# Altium schematic sheet System Block.SchDoc
size A0; SheetNumber: 1; SheetTotal: 9
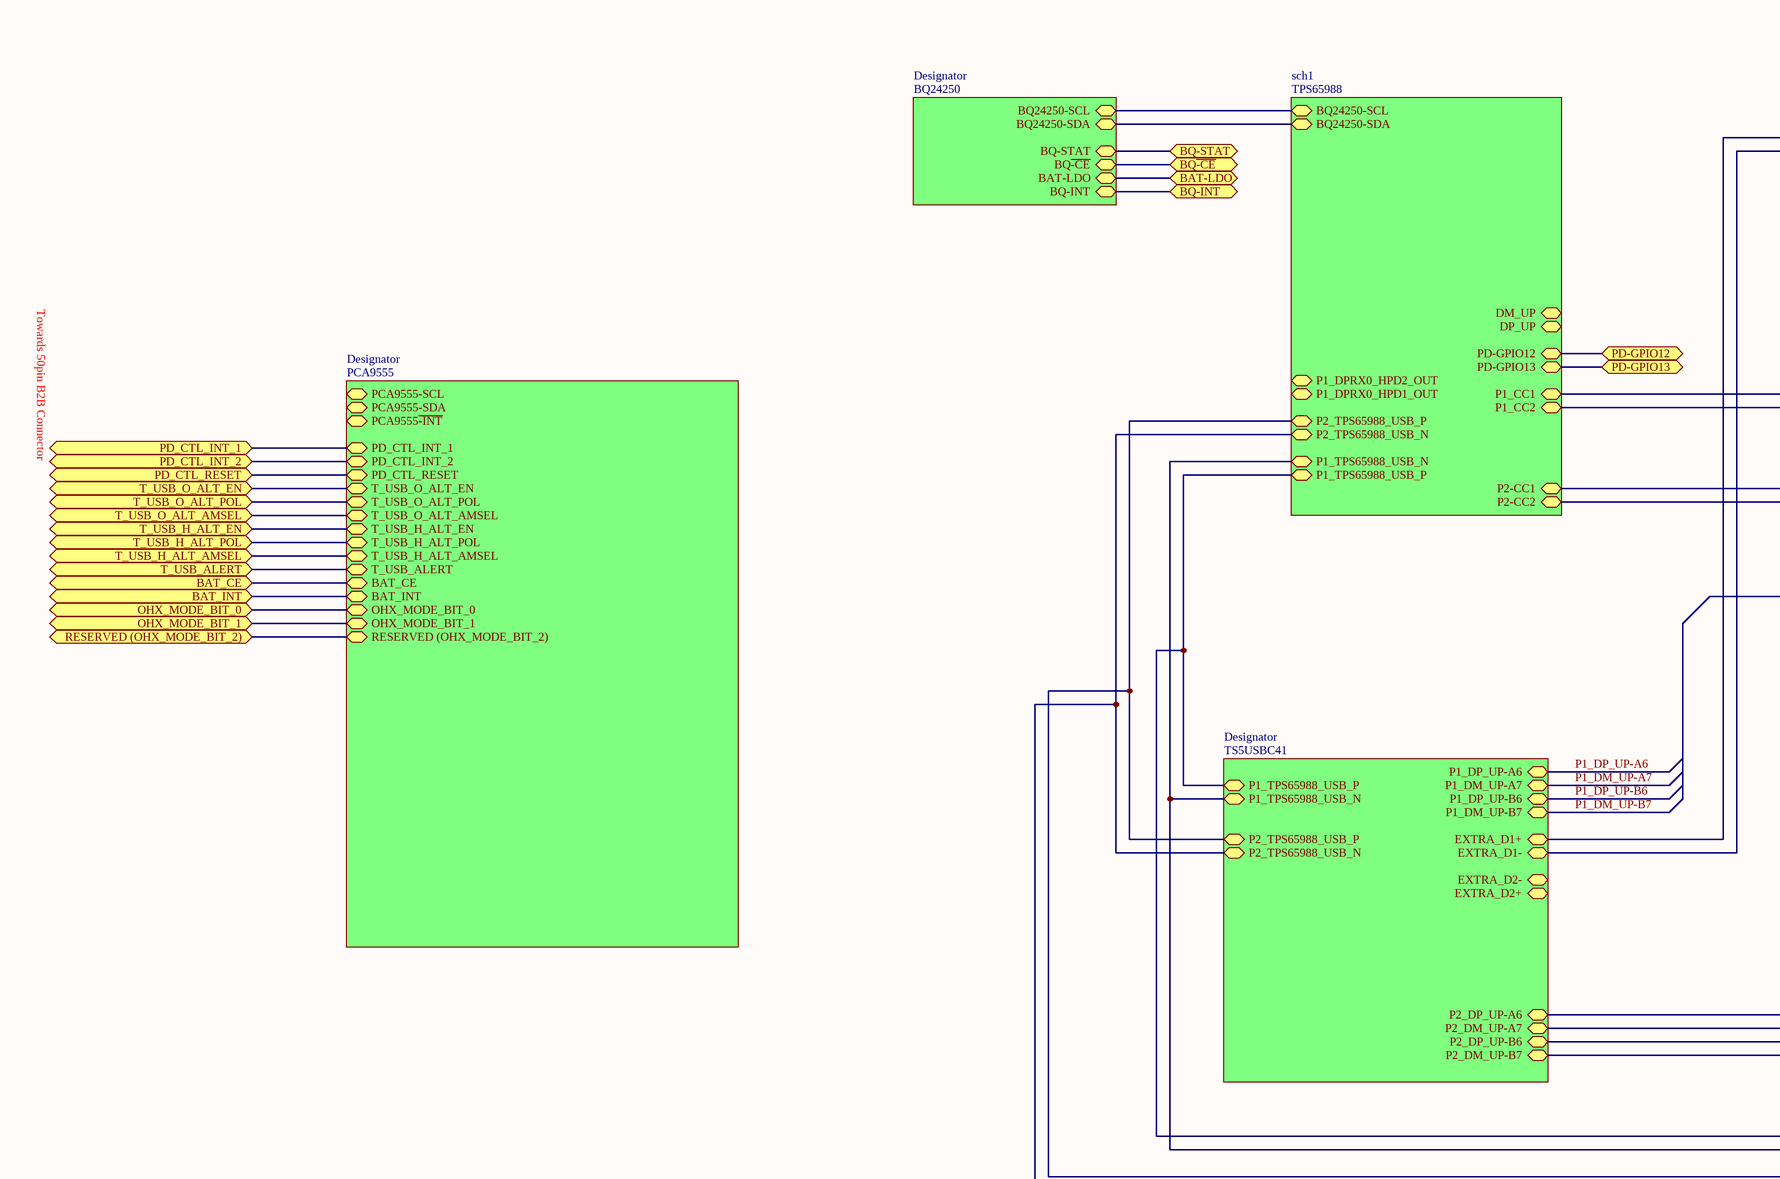
[diagram p0: System Block.SchDoc, top left]
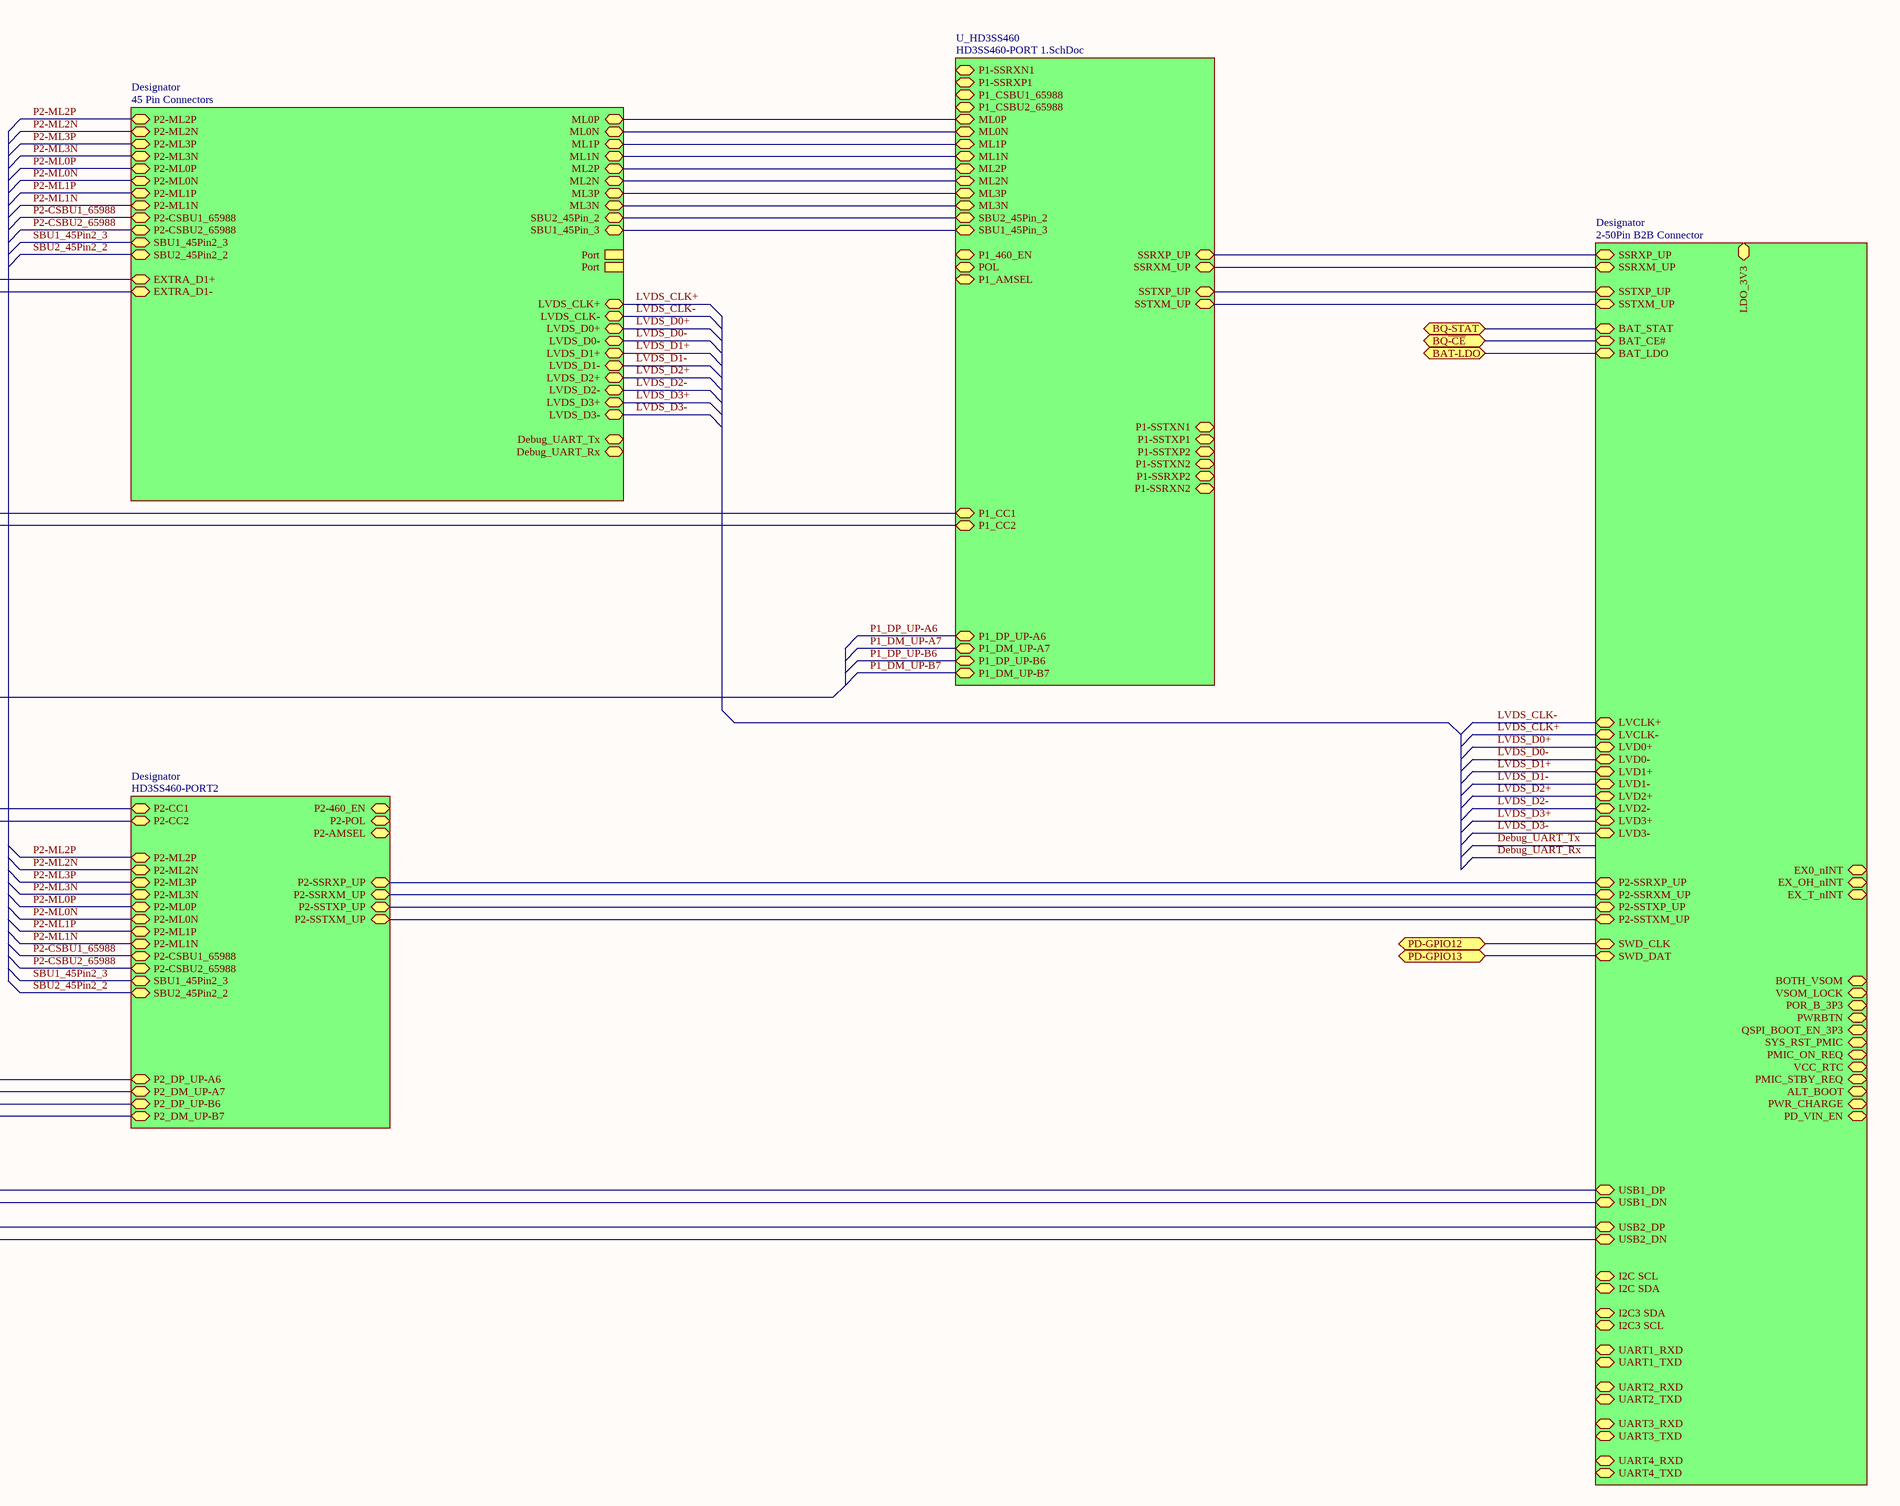
[diagram p1: System Block.SchDoc, top right]

## Sub-sheets
Designator = TS5USBC41: P1_DM_UP-A7 (bidir), P1_DP_UP-A6 (bidir), P1_DP_UP-B6 (bidir), P1_DM_UP-B7 (bidir), P1_TPS65988_USB_P (bidir), P1_TPS65988_USB_N (bidir), P2_DP_UP-A6 (bidir), P2_DM_UP-A7 (bidir), P2_DP_UP-B6 (bidir), P2_DM_UP-B7 (bidir), P2_TPS65988_USB_P (bidir), P2_TPS65988_USB_N (bidir), EXTRA_D2+ (bidir), EXTRA_D2- (bidir), EXTRA_D1+ (bidir), EXTRA_D1- (bidir)
Designator = HD3SS460-PORT2: P2_DP_UP-A6 (bidir), P2-CSBU1_65988 (bidir), P2-AMSEL (bidir), P2-POL (bidir), P2-CSBU2_65988 (bidir), P2-CC1 (bidir), P2-CC2 (bidir), P2-SSTXP_UP (bidir), P2-SSTXM_UP (bidir), P2-SSRXM_UP (bidir), P2-SSRXP_UP (bidir), P2-ML2P (bidir), P2-ML2N (bidir), P2-ML3P (bidir), P2-ML3N (bidir), P2-ML0P (bidir), P2-ML0N (bidir), P2-460_EN (bidir), P2-ML1P (bidir), P2-ML1N (bidir), P2_DM_UP-A7 (bidir), P2_DP_UP-B6 (bidir), P2_DM_UP-B7 (bidir), SBU1_45Pin2_3 (bidir), SBU2_45Pin2_2 (bidir)
Designator = BQ24250: BQ-STAT (bidir), BQ~{-CE} (bidir), BQ-INT (bidir), BQ24250-SCL (bidir), BQ24250-SDA (bidir), BAT-LDO (bidir)
Designator = 2-50Pin B2B Connector: USB1_DN (bidir), USB1_DP (bidir), USB2_DP (bidir), USB2_DN (bidir), SWD_CLK (bidir), SWD_DAT (bidir), BOTH_VSOM (bidir), EX0_nINT (bidir), EX_T_nINT (bidir), EX_OH_nINT (bidir), VSOM_LOCK (bidir), SYS_RST_PMIC (bidir), PMIC_ON_REQ (bidir), POR_B_3P3 (bidir), PMIC_STBY_REQ (bidir), ALT_BOOT (bidir), PWRBTN (bidir), PWR_CHARGE (bidir), BAT_CE# (bidir), QSPI_BOOT_EN_3P3 (bidir), PD_VIN_EN (bidir), BAT_STAT (bidir), BAT_LDO (bidir), VCC_RTC (bidir), LDO_3V3 (bidir), I2C3 SDA (bidir), I2C3 SCL (bidir), LVD3- (bidir), LVD3+ (bidir), LVD2- (bidir), I2C SCL (bidir), I2C SDA (bidir), UART4_RXD (bidir), UART4_TXD (bidir), LVD2+ (bidir), UART3_RXD (bidir), LVD1+ (bidir), UART3_TXD (bidir), LVD1- (bidir), LVD0- (bidir), UART2_RXD (bidir), UART2_TXD (bidir), LVD0+ (bidir), UART1_TXD (bidir), UART1_RXD (bidir), LVCLK+ (bidir), LVCLK- (bidir), SSRXP_UP (bidir), SSRXM_UP (bidir), SSTXP_UP (bidir), SSTXM_UP (bidir), P2-SSRXP_UP (bidir), P2-SSRXM_UP (bidir), P2-SSTXP_UP (bidir), P2-SSTXM_UP (bidir)
Designator = 45 Pin Connectors: SBU2_45Pin_2 (bidir), SBU1_45Pin_3 (bidir), ML0N (bidir), ML0P (bidir), ML1P (bidir), ML1N (bidir), ML2P (bidir), ML2N (bidir), ML3P (bidir), ML3N (bidir), EXTRA_D1+ (bidir), Port, EXTRA_D1- (bidir), Port, LVDS_CLK- (bidir), LVDS_CLK+ (bidir), LVDS_D0+ (bidir), LVDS_D0- (bidir), LVDS_D1+ (bidir), LVDS_D1- (bidir), LVDS_D2+ (bidir), LVDS_D2- (bidir), LVDS_D3- (bidir), LVDS_D3+ (bidir), Debug_UART_Tx (bidir), Debug_UART_Rx (bidir), P2-ML2P (bidir), P2-ML2N (bidir), P2-ML3P (bidir), P2-ML3N (bidir), P2-ML0P (bidir), P2-ML0N (bidir), P2-ML1P (bidir), P2-ML1N (bidir), P2-CSBU1_65988 (bidir), P2-CSBU2_65988 (bidir), SBU1_45Pin2_3 (bidir), SBU2_45Pin2_2 (bidir)
Designator = PCA9555: PCA9555-SCL (bidir), PCA9555-SDA (bidir), PCA9555~{-INT} (bidir), PD_CTL_INT_1 (bidir), PD_CTL_INT_2 (bidir), PD_CTL_RESET (bidir), T_USB_O_ALT_EN (bidir), T_USB_O_ALT_POL (bidir), T_USB_O_ALT_AMSEL (bidir), T_USB_H_ALT_EN (bidir), T_USB_H_ALT_POL (bidir), T_USB_H_ALT_AMSEL (bidir), T_USB_ALERT (bidir), BAT_CE (bidir), BAT_INT (bidir), OHX_MODE_BIT_0 (bidir), OHX_MODE_BIT_1 (bidir), RESERVED (OHX_MODE_BIT_2) (bidir)
sch1 = TPS65988: DM_UP (bidir), DP_UP (bidir), P1_CC1 (bidir), P1_CC2 (bidir), P1_DPRX0_HPD1_OUT (bidir), P1_DPRX0_HPD2_OUT (bidir), P1_TPS65988_USB_P (bidir), P1_TPS65988_USB_N (bidir), P2_TPS65988_USB_P (bidir), P2_TPS65988_USB_N (bidir), P2-CC1 (bidir), P2-CC2 (bidir), BQ24250-SCL (bidir), BQ24250-SDA (bidir), PD-GPIO12 (bidir), PD-GPIO13 (bidir)
U_HD3SS460 = HD3SS460-PORT 1.SchDoc: P1_CC2 (bidir), P1_CSBU1_65988 (bidir), P1_CSBU2_65988 (bidir), P1_DM_UP-A7 (bidir), P1_DP_UP-A6 (bidir), POL (bidir), P1_AMSEL (bidir), P1_460_EN (bidir), ML1P (bidir), ML1N (bidir), ML0N (bidir), ML0P (bidir), ML3N (bidir), ML3P (bidir), ML2P (bidir), ML2N (bidir), SSTXM_UP (bidir), SSTXP_UP (bidir), SSRXP_UP (bidir), SSRXM_UP (bidir), P1_DP_UP-B6 (bidir), P1_DM_UP-B7 (bidir), P1-SSRXP1 (bidir), P1-SSRXN1 (bidir), P1-SSTXP1 (bidir), P1-SSTXN1 (bidir), P1-SSRXP2 (bidir), P1-SSRXN2 (bidir), P1-SSTXP2 (bidir), P1-SSTXN2 (bidir), SBU1_45Pin_3 (bidir), SBU2_45Pin_2 (bidir), P1_CC1 (bidir)

## Ports
BAT-LDO (bidir), BAT_CE (bidir), BAT_INT (bidir), BQ-INT (bidir), BQ-STAT (bidir), BQ~{-CE} (bidir), OHX_MODE_BIT_0 (bidir), OHX_MODE_BIT_1 (bidir), PD-GPIO12 (bidir), PD-GPIO13 (bidir), PD_CTL_INT_1 (bidir), PD_CTL_INT_2 (bidir), PD_CTL_RESET (bidir), RESERVED (OHX_MODE_BIT_2) (bidir), T_USB_ALERT (bidir), T_USB_H_ALT_AMSEL (bidir), T_USB_H_ALT_EN (bidir), T_USB_H_ALT_POL (bidir), T_USB_O_ALT_AMSEL (bidir), T_USB_O_ALT_EN (bidir), T_USB_O_ALT_POL (bidir)

## Nets
BAT-LDO: port BAT-LDO, sheet Designator/BAT-LDO, sheet Designator/BAT_LDO
BAT_CE: port BAT_CE, sheet Designator/BAT_CE
BAT_INT: port BAT_INT, sheet Designator/BAT_INT
BQ~{-CE}: port BQ~{-CE}, sheet Designator/BQ~{-CE}, sheet Designator/BAT_CE#
BQ-INT: port BQ-INT, sheet Designator/BQ-INT
BQ-STAT: port BQ-STAT, sheet Designator/BQ-STAT, sheet Designator/BAT_STAT
LVDS_CLK+: sheet Designator/LVCLK-, sheet Designator/LVDS_CLK+
LVDS_CLK-: sheet Designator/LVCLK+, sheet Designator/LVDS_CLK-
LVDS_D0+: sheet Designator/LVD0+, sheet Designator/LVDS_D0+
LVDS_D0-: sheet Designator/LVD0-, sheet Designator/LVDS_D0-
LVDS_D1+: sheet Designator/LVD1+, sheet Designator/LVDS_D1+
LVDS_D1-: sheet Designator/LVD1-, sheet Designator/LVDS_D1-
LVDS_D2+: sheet Designator/LVD2+, sheet Designator/LVDS_D2+
LVDS_D2-: sheet Designator/LVD2-, sheet Designator/LVDS_D2-
LVDS_D3+: sheet Designator/LVD3+, sheet Designator/LVDS_D3+
LVDS_D3-: sheet Designator/LVD3-, sheet Designator/LVDS_D3-
OHX_MODE_BIT_0: port OHX_MODE_BIT_0, sheet Designator/OHX_MODE_BIT_0
OHX_MODE_BIT_1: port OHX_MODE_BIT_1, sheet Designator/OHX_MODE_BIT_1
P1_DM_UP-A7: sheet U_HD3SS460/P1_DM_UP-A7, sheet Designator/P1_DM_UP-A7
P1_DM_UP-B7: sheet U_HD3SS460/P1_DM_UP-B7, sheet Designator/P1_DM_UP-B7
P1_DP_UP-A6: sheet U_HD3SS460/P1_DP_UP-A6, sheet Designator/P1_DP_UP-A6
P1_DP_UP-B6: sheet U_HD3SS460/P1_DP_UP-B6, sheet Designator/P1_DP_UP-B6
P2-CSBU1_65988: sheet Designator/P2-CSBU1_65988, sheet Designator/P2-CSBU1_65988
P2-CSBU2_65988: sheet Designator/P2-CSBU2_65988, sheet Designator/P2-CSBU2_65988
P2-ML0N: sheet Designator/P2-ML0N, sheet Designator/P2-ML0N
P2-ML0P: sheet Designator/P2-ML0P, sheet Designator/P2-ML0P
P2-ML1N: sheet Designator/P2-ML1N, sheet Designator/P2-ML1N
P2-ML1P: sheet Designator/P2-ML1P, sheet Designator/P2-ML1P
P2-ML2N: sheet Designator/P2-ML2N, sheet Designator/P2-ML2N
P2-ML2P: sheet Designator/P2-ML2P, sheet Designator/P2-ML2P
P2-ML3N: sheet Designator/P2-ML3N, sheet Designator/P2-ML3N
P2-ML3P: sheet Designator/P2-ML3P, sheet Designator/P2-ML3P
PD-GPIO12: port PD-GPIO12, sheet sch1/PD-GPIO12, sheet Designator/SWD_CLK
PD-GPIO13: port PD-GPIO13, sheet sch1/PD-GPIO13, sheet Designator/SWD_DAT
PD_CTL_INT_1: port PD_CTL_INT_1, sheet Designator/PD_CTL_INT_1
PD_CTL_INT_2: port PD_CTL_INT_2, sheet Designator/PD_CTL_INT_2
PD_CTL_RESET: port PD_CTL_RESET, sheet Designator/PD_CTL_RESET
RESERVED (OHX_MODE_BIT_2): port RESERVED (OHX_MODE_BIT_2), sheet Designator/RESERVED (OHX_MODE_BIT_2)
SBU1_45Pin2_3: sheet Designator/SBU1_45Pin2_3, sheet Designator/SBU1_45Pin2_3
SBU2_45Pin2_2: sheet Designator/SBU2_45Pin2_2, sheet Designator/SBU2_45Pin2_2
T_USB_ALERT: port T_USB_ALERT, sheet Designator/T_USB_ALERT
T_USB_H_ALT_AMSEL: port T_USB_H_ALT_AMSEL, sheet Designator/T_USB_H_ALT_AMSEL
T_USB_H_ALT_EN: port T_USB_H_ALT_EN, sheet Designator/T_USB_H_ALT_EN
T_USB_H_ALT_POL: port T_USB_H_ALT_POL, sheet Designator/T_USB_H_ALT_POL
T_USB_O_ALT_AMSEL: port T_USB_O_ALT_AMSEL, sheet Designator/T_USB_O_ALT_AMSEL
T_USB_O_ALT_EN: port T_USB_O_ALT_EN, sheet Designator/T_USB_O_ALT_EN
T_USB_O_ALT_POL: port T_USB_O_ALT_POL, sheet Designator/T_USB_O_ALT_POL
(unnamed): sheet sch1/P1_CC1, sheet U_HD3SS460/P1_CC1
(unnamed): sheet sch1/P1_CC2, sheet U_HD3SS460/P1_CC2
(unnamed): sheet sch1/P1_TPS65988_USB_P, sheet Designator/P1_TPS65988_USB_P, sheet Designator/USB1_DP
(unnamed): sheet sch1/P1_TPS65988_USB_N, sheet Designator/P1_TPS65988_USB_N, sheet Designator/USB1_DN
(unnamed): sheet sch1/P2_TPS65988_USB_P, sheet Designator/P2_TPS65988_USB_P, sheet Designator/USB2_DP
(unnamed): sheet sch1/P2_TPS65988_USB_N, sheet Designator/P2_TPS65988_USB_N, sheet Designator/USB2_DN
(unnamed): sheet sch1/P2-CC1, sheet Designator/P2-CC1
(unnamed): sheet sch1/P2-CC2, sheet Designator/P2-CC2
(unnamed): sheet sch1/BQ24250-SCL, sheet Designator/BQ24250-SCL
(unnamed): sheet sch1/BQ24250-SDA, sheet Designator/BQ24250-SDA
(unnamed): sheet U_HD3SS460/ML1P, sheet Designator/ML1P
(unnamed): sheet U_HD3SS460/ML1N, sheet Designator/ML1N
(unnamed): sheet U_HD3SS460/ML0N, sheet Designator/ML0N
(unnamed): sheet U_HD3SS460/ML0P, sheet Designator/ML0P
(unnamed): sheet U_HD3SS460/ML3N, sheet Designator/ML3N
(unnamed): sheet U_HD3SS460/ML3P, sheet Designator/ML3P
(unnamed): sheet U_HD3SS460/ML2P, sheet Designator/ML2P
(unnamed): sheet U_HD3SS460/ML2N, sheet Designator/ML2N
(unnamed): sheet U_HD3SS460/SSTXM_UP, sheet Designator/SSTXM_UP
(unnamed): sheet U_HD3SS460/SSTXP_UP, sheet Designator/SSTXP_UP
(unnamed): sheet U_HD3SS460/SSRXP_UP, sheet Designator/SSRXP_UP
(unnamed): sheet U_HD3SS460/SSRXM_UP, sheet Designator/SSRXM_UP
(unnamed): sheet U_HD3SS460/SBU1_45Pin_3, sheet Designator/SBU1_45Pin_3
(unnamed): sheet U_HD3SS460/SBU2_45Pin_2, sheet Designator/SBU2_45Pin_2
(unnamed): sheet Designator/P2_DP_UP-A6, sheet Designator/P2_DP_UP-A6
(unnamed): sheet Designator/P2_DM_UP-A7, sheet Designator/P2_DM_UP-A7
(unnamed): sheet Designator/P2_DP_UP-B6, sheet Designator/P2_DP_UP-B6
(unnamed): sheet Designator/P2_DM_UP-B7, sheet Designator/P2_DM_UP-B7
(unnamed): sheet Designator/EXTRA_D1+, sheet Designator/EXTRA_D1+
(unnamed): sheet Designator/EXTRA_D1-, sheet Designator/EXTRA_D1-
(unnamed): sheet Designator/P2-SSTXP_UP, sheet Designator/P2-SSTXP_UP
(unnamed): sheet Designator/P2-SSTXM_UP, sheet Designator/P2-SSTXM_UP
(unnamed): sheet Designator/P2-SSRXM_UP, sheet Designator/P2-SSRXM_UP
(unnamed): sheet Designator/P2-SSRXP_UP, sheet Designator/P2-SSRXP_UP

## Notes on the sheet
- Towards 50pin B2B Connector